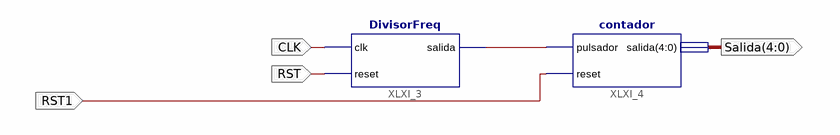
[diagram p0: schematic sheet 1]
// Xilinx ISE schematic Main.sch (spartan3a) as structural Verilog: 2 symbols, 4 ports
module Main (
  input  CLK,
  input  RST,
  input  RST1,
  output [4:0] Salida
);

  wire XLXN_1;

  DivisorFreq XLXI_3 (.clk(CLK), .reset(RST), .salida(XLXN_1));
  contador XLXI_4 (.pulsador(XLXN_1), .reset(RST1), .salida(Salida));
endmodule
